# EAGLE design devkit (EAGLE 7.7.0)
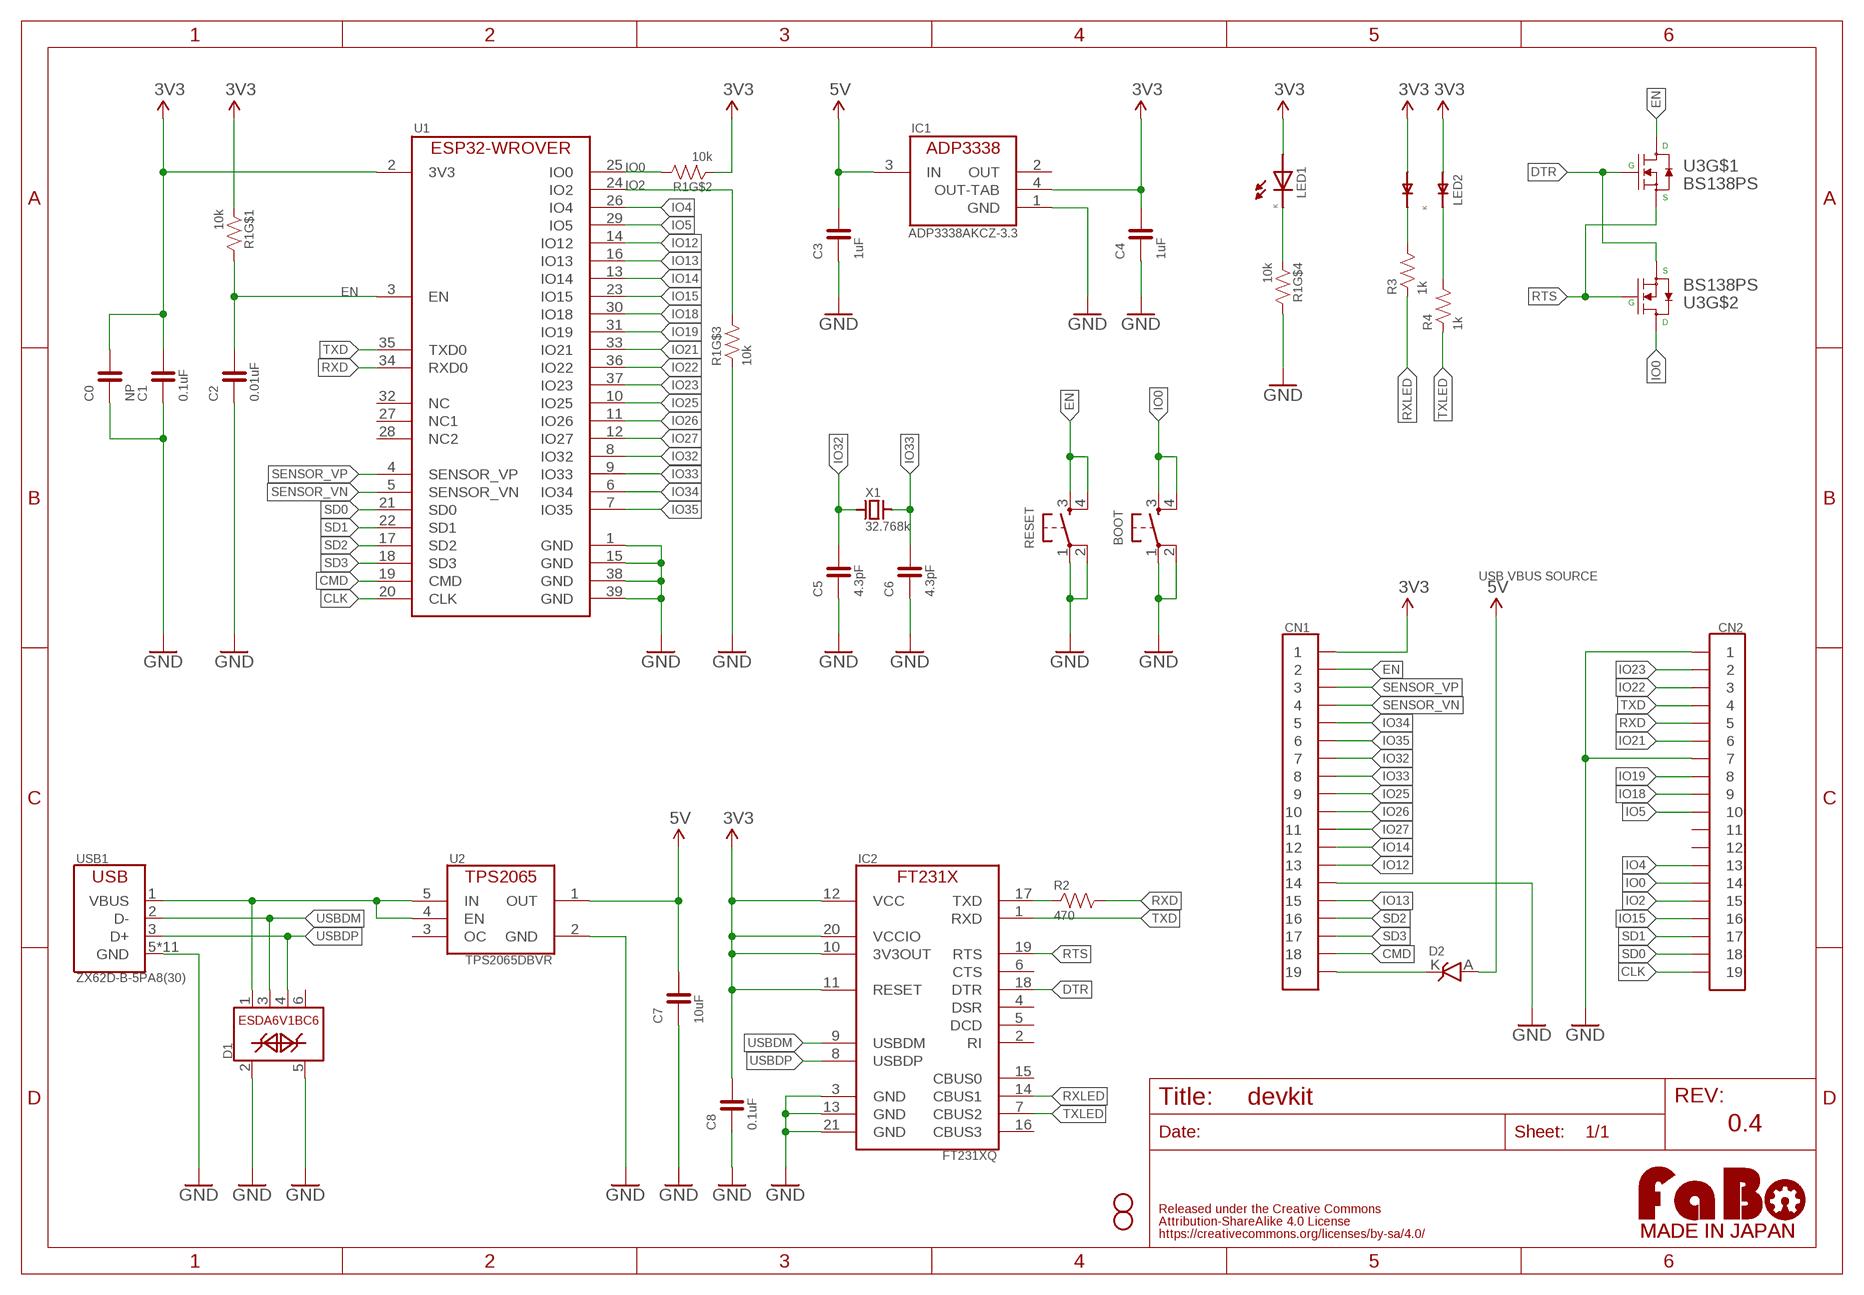
[diagram p0: schematic, sheet 1]

## Parts
BOOT  TACTILE-KMR2  [KMR2-TACT]
C0  NP  CAPACITOR-M  [MULTIPAD0603]
C1  0.1uF  CAPACITOR-0603  [EIA0603]
C2  0.01uF  CAPACITOR-0603  [EIA0603]
C3  1uF  CAPACITOR-0603  [EIA0603]
C4  1uF  CAPACITOR-0603  [EIA0603]
C5  4.3pF  CAPACITOR-0603  [EIA0603]
C6  4.3pF  CAPACITOR-0603  [EIA0603]
C7  10uF  CAPACITOR-0603  [EIA0603]
C8  0.1uF  CAPACITOR-0603  [EIA0603]
CN1  PIN_1X19  [PIN_1X19]
CN2  PIN_1X19  [PIN_1X19]
D1  ESDA6V1BC6  [SOT-23-6L]
D2  DIODE_SCHOTTKY-RB161MM-20  [SOD-123FL_RB161MM-20]
FID1  FIDUCIAL-TOP  [FIDUCIAL_15_TOP]
FID2  FIDUCIAL-TOP  [FIDUCIAL_15_TOP]
IC1  ADP3338AKCZ-3.3  ADP3338AKCZ  [SOT-223-KC3]
IC2  FT231XQ  [QFN-20]
LED1  LED-0603  [LED_0603]
LED2  HSMF-C16X  [HSMF-C16X]
LOGO1  LOGO_FABO-M_BOTTOM  [LOGO_FABO_M_BOTTOM]
R1  10k  RESISTOR_ARRAY  [EXBV8V]
R2  470  RESISTOR-0603  [EIA0603]
R3  1k  RESISTOR-0603  [EIA0603]
R4  1k  RESISTOR-0603  [EIA0603]
RESET  TACTILE-KMR2  [KMR2-TACT]
U1  ESP32-WROVER-B  [ESP32-WROVER-B]
U2  TPS2065DBVR  TPS2065DBV  [SOT-23-5]
U3  BS138PS  [SOT-363]
USB1  ZX62D-B-5PA8(30)  USB-ZX62D  [ZX62D-B-5PA8]
X1  32.768k  CRYSTAL-ABS07  [ABS07]

## Nets
3V3: C0.2 C1.2 C4.2 C8.2 CN1.1 IC1.4(OUT-TAB) IC2.10(3V3OUT) IC2.11(RESET) IC2.12(VCC) IC2.20(VCCIO) LED1.A(ANODE) LED2.1(A1) LED2.2(A2) R1.1 R1.2 U1.2(3V3)
5V: C3.2 C7.2 D2.A IC1.3(IN) U2.1(OUT)
CLK: CN2.19 U1.20(CLK)
CMD: CN1.18 U1.19(CMD)
DTR: IC2.18(DTR) U3.2(G) U3.4(S)
EN: C2.2 CN1.2 R1.8 RESET.3 RESET.4 U1.3(EN) U3.6(D)
GND: BOOT.1 BOOT.2 C0.1 C1.1 C2.1 C3.1 C4.1 C5.1 C6.1 C7.1 C8.1 CN1.14 CN2.1 CN2.7 D1.2 D1.5 IC1.1(GND) IC2.3(GND) IC2.13(GND) IC2.21(GND) R1.3 R1.5 RESET.1 RESET.2 U1.1(GND) U1.15(GND) U1.38(GND) U1.39(GND) U2.2(GND) USB1.5(GND) USB1.B1(GND) USB1.B2(GND) USB1.B3(GND) USB1.B4(GND) USB1.T1(GND) USB1.T2(GND) USB1.T3(GND) USB1.T4(GND) USB1.T5(GND) USB1.T6(GND)
IO0: BOOT.3 BOOT.4 CN2.14 R1.7 U1.25(IO0) U3.3(D)
IO2: CN2.15 R1.6 U1.24(IO2)
IO4: CN2.13 U1.26(IO4)
IO5: CN2.10 U1.29(IO5)
IO12: CN1.13 U1.14(IO12)
IO13: CN1.15 U1.16(IO13)
IO14: CN1.12 U1.13(IO14)
IO15: CN2.16 U1.23(IO15)
IO18: CN2.9 U1.30(IO18)
IO19: CN2.8 U1.31(IO19)
IO21: CN2.6 U1.33(IO21)
IO22: CN2.3 U1.36(IO22)
IO23: CN2.2 U1.37(IO23)
IO25: CN1.9 U1.10(IO25)
IO26: CN1.10 U1.11(IO26)
IO27: CN1.11 U1.12(IO27)
IO32: C5.2 CN1.7 U1.8(IO32) X1.1
IO33: C6.2 CN1.8 U1.9(IO33) X1.2
IO34: CN1.5 U1.6(IO34)
IO35: CN1.6 U1.7(IO35)
LED1K: LED1.K(CATHODE) R1.4
LED2K1: LED2.4(K2) R3.2
LED2K2: LED2.3(K1) R4.2
OUT5V: CN1.19 D2.K
RTS: IC2.19(RTS) U3.1(S) U3.5(G)
RXD: CN2.5 R2.2 U1.34(RXD0)
RXLED: IC2.14(CBUS1) R3.1
SD0: CN2.18 U1.21(SD0)
SD1: CN2.17 U1.22(SD1)
SD2: CN1.16 U1.17(SD2)
SD3: CN1.17 U1.18(SD3)
SENSOR_VN: CN1.4 U1.5(SENSOR_VN)
SENSOR_VP: CN1.3 U1.4(SENSOR_VP)
TXD: CN2.4 IC2.1(RXD) U1.35(TXD0)
TXLED: IC2.7(CBUS2) R4.1
TXPIN: IC2.17(TXD) R2.1
USBDM: D1.3 IC2.9(USBDM) USB1.2(D-)
USBDP: D1.4 IC2.8(USBDP) USB1.3(D+)
USBVBUS: D1.1 U2.4(EN) U2.5(IN) USB1.1(VBUS)
Unconnected: CN2.11 CN2.12 D1.6 IC1.2(OUT) IC2.2(RI) IC2.4(DSR) IC2.5(DCD) IC2.6(CTS) IC2.15(CBUS0) IC2.16(CBUS3) U1.27(NC1) U1.28(NC2) U1.32(NC) U2.3(OC)

## Notes on the sheet
- USB VBUS SOURCE
- 0.4

## Library data of the parts
BOOT RESET = component:TACTILE
C0 C1-C8 = component:CAPACITOR
CN1 CN2 = component:PIN_1X19
D1 = component:ESDA6V1BC6
D2 = component:DIODE_SCHOTTKY
FID1 FID2 = component:FIDUCIAL
IC1 = component:ADP3338AKCZ
IC2 = component:FT231X
LED1 = component:LED
LED2 = component:HSMF-C16X
LOGO1 = component:LOGO_FABO
R1 = component:RESISTOR_ARRAY
R2-R4 = component:RESISTOR
U1 = component:ESP32-WROVER-B
U2 = component:TPS2065
U3 = component:BS138PS
USB1 = component:USB
X1 = component:CRYSTAL

## Board
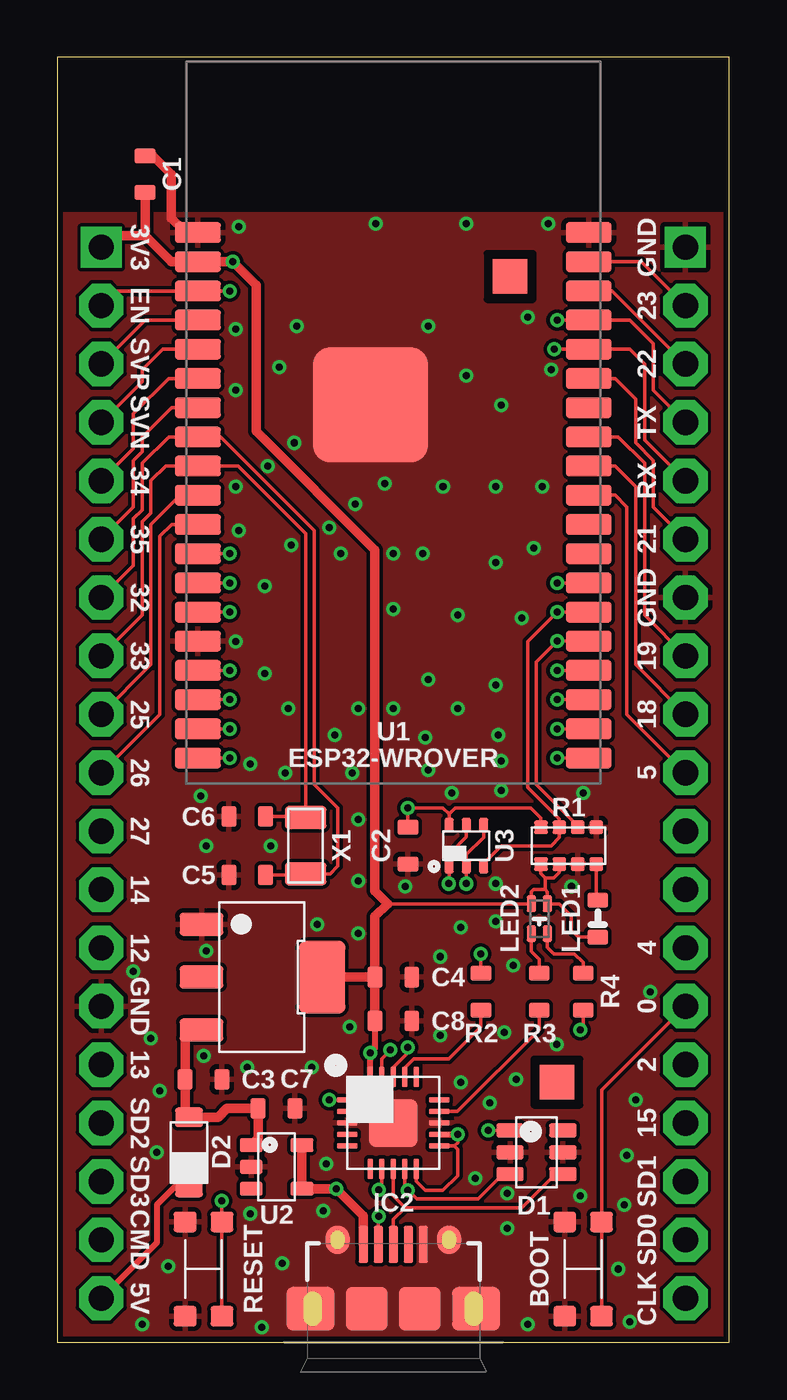
[diagram p1: board, top side]
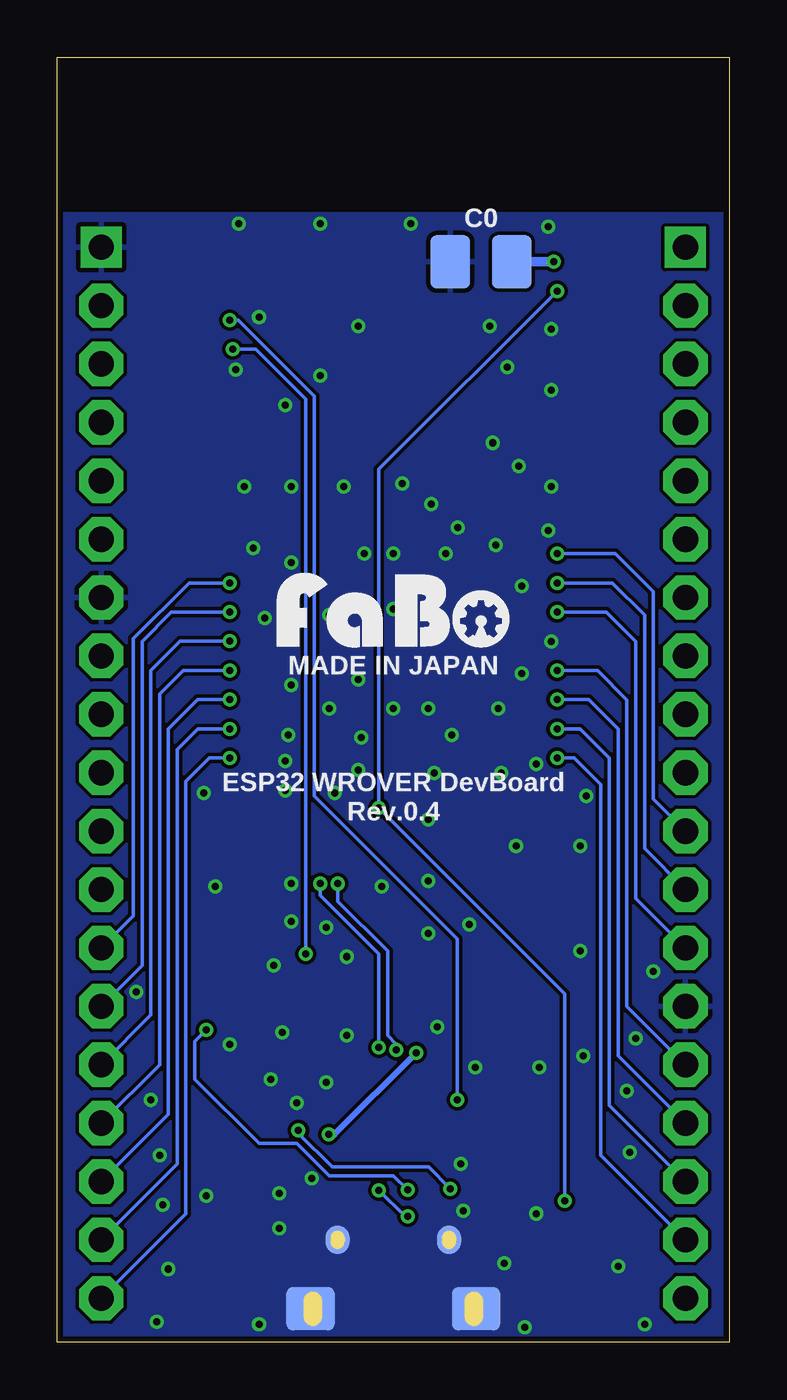
[diagram p2: board, bottom side, seen from below]

Size 29.21 x 55.88 mm. Coordinates in mm from the lower left corner, seen from the top.
Outline: 0,0 29.21,0 29.21,55.88 0,55.88 0,0
Copper layers (1*16): Top 0.035mm / dielectric 1.6mm / Bottom 0.035mm
Design rules "PCBway": minimum track width 6mil, minimum drill 12mil, track to track 6mil, track to pad 6mil, pad to pad 6mil, via to via 6mil, smd to smd 6mil, copper to edge 10mil, drill to drill 10mil, minimum pad ring 10mil, minimum via ring 6mil, stop-mask expansion 2mil, vias tented up to drill 100mil, thermal gap 8mil

### Footprints (pad centres in the part's own frame; a part is rotated, then mirrored left to right if it is on the bottom)
KMR2-TACT = smd 0.9 x 1: 1 -2.05,0.8; 2 2.05,0.8; 3 2.05,-0.8; 4 -2.05,-0.8
MULTIPAD0603 = smd 1.725 x 2.3: 1 -1.337,0; 2 1.337,0
EIA0603 = smd 0.65 x 0.9: 1 -0.8,0; 2 0.8,0
PIN_1X19 = drill 1.1 pad 1.778 square: 1 -22.86,0 | drill 1.1 pad 1.93 octagon: 2 -20.32,0; 3 -17.78,0; 4 -15.24,0; 5 -12.7,0; 6 -10.16,0; 7 -7.62,0; 8 -5.08,0; 9 -2.54,0; 10 0,0; 11 2.54,0; 12 5.08,0; 13 7.62,0; 14 10.16,0; 15 12.7,0; 16 15.24,0; 17 17.78,0; 18 20.32,0; 19 22.86,0
SOT-23-6L = smd 0.6 x 1.2: 1 -0.95,-1.15; 2 0,-1.15; 3 0.95,-1.15; 4 0.95,1.15; 5 0,1.15; 6 -0.95,1.15
SOD-123FL_RB161MM-20 = smd 0.85 x 1.2: A 1.525,0; K -1.525,0
FIDUCIAL_15_TOP = smd 1.5 x 1.5: P$1 0,0
SOT-223-KC3 = smd 1 x 1.9: 1 -2.3,-2.625; 2 0,-2.625; 3 2.3,-2.625 | smd 3.15 x 2: 4 0,2.625
QFN-20 = smd 0.9 x 0.25: 1 -2,1; 2 -2,0.5; 3 -2,0; 4 -2,-0.5; 5 -2,-1; 11 2,-1; 12 2,-0.5; 13 2,0; 14 2,0.5; 15 2,1 | smd 0.25 x 0.9: 6 -1,-2; 7 -0.5,-2; 8 0,-2; 9 0.5,-2; 10 1,-2; 16 1,2; 17 0.5,2; 18 0,2; 19 -0.5,2; 20 -1,2 | smd 2.1 x 2.1: 21 0,0
LED_0603 = smd 0.65 x 0.9: A -0.8,0; K 0.8,0
HSMF-C16X = smd 0.7 x 0.4: 1 -0.65,0.35; 2 -0.65,-0.35; 3 0.65,0.35; 4 0.65,-0.35
EXBV8V = smd 0.6 x 0.6: 1 -1.2,-0.8; 2 -0.4,-0.8; 3 0.4,-0.8; 4 1.2,-0.8; 5 1.2,0.8; 6 0.4,0.8; 7 -0.4,0.8; 8 -1.2,0.8
ESP32-WROVER-B = smd 2 x 0.9: 1 -8.5,8.26; 2 -8.5,6.99; 3 -8.5,5.72; 4 -8.5,4.45; 5 -8.5,3.18; 6 -8.5,1.91; 7 -8.5,0.64; 8 -8.5,-0.63; 9 -8.5,-1.9; 10 -8.5,-3.17; 11 -8.5,-4.44; 12 -8.5,-5.71; 13 -8.5,-6.98; 14 -8.5,-8.25; 15 -8.5,-9.52; 16 -8.5,-10.79; 17 -8.5,-12.06; 18 -8.5,-13.33; 19 -8.5,-14.6; 20 8.5,-14.6; 21 8.5,-13.33; 22 8.5,-12.06; 23 8.5,-10.79; 24 8.5,-9.52; 25 8.5,-8.25; 26 8.5,-6.98; 27 8.5,-5.71; 28 8.5,-4.44; 29 8.5,-3.17; 30 8.5,-1.9; 31 8.5,-0.63; 32 8.5,0.64; 33 8.5,1.91; 34 8.5,3.18; 35 8.5,4.45; 36 8.5,5.72; 37 8.5,6.99; 38 8.5,8.26 | smd 5 x 5: 39 -1,0.76
SOT-23-5 = smd 0.6 x 1: 1 -0.95,-1.1; 2 0,-1.1; 3 0.95,-1.1; 4 0.95,1.1; 5 -0.95,1.1
SOT-363 = smd 0.6 x 0.4: 1 -0.9,0.75; 2 -0.9,0; 3 -0.9,-0.75; 4 0.9,-0.75; 5 0.9,0; 6 0.9,0.75
ZX62D-B-5PA8 = smd 0.4 x 1.6: 1 -1.3,4.25; 2 -0.65,4.25; 3 0,4.25; 4 0.65,4.25; 5 1.3,4.25 | smd 1.05 x 1.25 bottom: B1 -2.425,4.45; B2 2.425,4.45 | smd 2.1 x 1.9 bottom: B3 -3.6,1.45; B4 3.6,1.45 | smd 1.05 x 1.25: T1 -2.425,4.45; T2 2.425,4.45 | smd 2.1 x 1.9: T3 -3.6,1.45; T6 3.6,1.45 | smd 1.8 x 1.9: T4 -1.15,1.45; T5 1.15,1.45
ABS07 = smd 1 x 1.8: 1 -1.225,0; 2 1.225,0

### Placement (x,y rotation side)
BOOT  22.86,3.17 90 top
C0  10.79,46.99 0 bottom
C1  3.81,50.8 270 top
C2  15.24,21.59 90 top
C3  6.35,11.43 180 top
C4  14.61,15.88 180 top
C5  8.26,20.32 0 top
C6  8.26,22.86 0 top
C7  9.53,10.16 180 top
C8  14.61,13.97 180 top
CN1  1.91,24.77 270 top
CN2  27.3,24.77 270 top
D1  20.83,8.26 270 top
D2  5.71,8.26 90 top
FID1  19.68,46.35 0 top
FID2  21.72,11.3 0 top
IC1  8.89,15.88 270 top
IC2  14.61,9.53 0 top
LED1  23.5,18.41 90 top
LED2  20.95,18.41 270 top
LOGO1  14.61,29.84 0 top
R1  22.23,21.59 0 top
R2  18.41,15.24 90 top
R3  20.95,15.24 90 top
R4  22.86,15.24 90 top
RESET  6.35,3.17 90 top
U1  14.61,40.01 0 top
U2  9.53,7.62 270 top
U3  17.78,21.59 90 top
USB1  14.61,0 0 top
X1  10.79,21.59 90 top

### Tracks (layer width: path | path; a pad name or v marks a point on that pad's centre or on a via)
3V3  (via drill 0.3)
  Top 0.152: IC2.10 15.61,7 16,6.6 16.76,6.6 17.4,7.24 17.4,8.38 17.26,8.53 | IC2.11 17.26,8.53 | v17.41,9.03 17.4,9.02 17.4,8.67 17.26,8.53 | 14.37,19.07 LED2.2 20.61,19.59 20.7,19.68 21.21,19.68 | R1.1 21.02,20.38 21.21,20.19 | 21.21,20.19 21.59,20.19 21.82,20.43 R1.2 | 21.21,19.68 21.3,19.59 LED2.1 21.83,19.07 22.35,18.54 22.35,17.91 22.64,17.61 LED1.A | 21.21,20.19 21.21,19.68
  Top 0.254: IC2.20 v13.61,12.59 13.8,12.79 C8.2 | IC2.12 v17.41,9.03
  Top 0.406: 3.81,48.13 4.95,46.99 U1.2 v7.62,46.99 8.64,45.98 8.64,39.62 13.8,34.45 13.8,19.63 14.37,19.07 13.8,18.5 C4.2 | C1.2 3.81,48.13 | 3.81,48.13 2.41,48.13 CN1.1 | C4.2 IC1.4 | C4.2 C8.2
  Bottom 0.254: v17.41,9.03 17.17,9.03 v13.61,12.59
  Bottom 0.406: C0.2 v7.62,46.99
5V
  Top 0.406: U2.1 8.72,8.87 C7.2 7.37,10.16 6.99,9.78 D2.A 5.55,9.95 C3.2 5.55,13.17 5.96,13.57 IC1.3
CLK  (via drill 0.3)
  Top 0.152: U1.20 v21.72,25.41
  Bottom 0.152: CN2.19 23.62,5.59 23.62,24.39 22.61,25.41 v21.72,25.41
CMD  (via drill 0.3)
  Top 0.152: U1.19 v7.49,25.41
  Bottom 0.152: CN1.18 5.59,8.13 5.59,24.26 6.74,25.41 v7.49,25.41
DTR  (via drill 0.3)
  Top 0.152: U3.4 18.53,21.96 17.78,21.21 U3.2 v17.78,19.94 | IC2.18 14.61,11.94 15.24,12.57 v15.24,12.83
  Bottom 0.152: v15.24,12.83 15.24,16.89 17.78,19.43 v17.78,19.94
EN  (via drill 0.3)
  Top 0.152: CN1.2 2.54,45.73 U1.3 v7.49,45.73 | RESET.4 RESET.3 v7.15,6.13 | C2.2 v15.24,23.24 16.76,23.24 17.03,22.98 | U3.6 17.03,22.98 | R1.8 21.02,22.79 20.57,23.24 17.3,23.24 17.03,22.98
  Bottom 0.152: v7.15,6.13 7.15,15.15 v15.24,23.24 15.24,37.97 v7.49,45.73
GND  (via drill 0.3)
  Top 0.406: C1.1 4.15,51.6 4.95,50.8 4.95,48.9 5.46,48.39 5.98,48.39 U1.1
  other vias: 19.3,24 9.14,38.1 21.34,48.64 13.84,48.64 17.78,48.64 21.46,42.29 20.45,44.58 17.78,42.04 19.3,40.77 20.19,31.5 17.4,31.62 19.05,28.57 21.08,37.21 19.05,37.21 14.22,37.34 16.76,37.21 12.32,34.29 14.61,34.29 15.88,34.29 10.16,34.67 7.75,37.21 11.81,35.43 12.95,36.45 10.29,39.12 7.87,35.31 9.91,24.77 12.83,24.77 16.13,24.89 19.18,26.42 19.3,25.27 16,26.29 14.61,27.56 13.08,27.56 10.03,27.56 8.38,25.15 6.22,23.75 6.48,21.59 9.27,21.59 13.08,22.73 13.08,20.07 15.11,19.81 20.7,34.54 19.05,33.91 10.41,44.2 9.65,42.42 7.75,44.07 7.75,41.4 16.13,44.2 9.02,32.89 9.02,29.08 16.13,28.83 12.06,26.42 19.05,18.29 19.05,19.94 13.08,17.78 11.3,18.16 6.48,17.02 12.7,13.72 16.64,13.34 16.64,16.76 19.81,16.38 21.72,12.95 19.43,13.46 17.53,11.3 18.8,10.41 11.05,11.94 8.26,11.94 4.45,10.92 4.06,13.21 6.35,12.45 4.32,8.26 8.38,5.59 11.56,5.71 11.68,7.75 9.78,3.43 4.83,3.3 3.68,0.76 8.89,0.64 24.89,0.89 24.38,3.17 24.64,5.97 20.45,0.76 19.56,4.95 18.16,7.11 19.56,6.48 22.73,6.35 24.77,8.13 25.15,10.54 19.94,11.43 17.53,18.03 3.3,16.13 25.78,15.24 22.35,19.81 22.86,23.88 17.14,23.88 14.61,31.88 7.75,30.48 7.87,48.51 17.4,27.56
  pour Top (isolate 0.152, rank 3): 0,0 29.21,0 29.21,49.08 0,49.08
  pour Bottom (isolate 0.152, rank 3): 0,0 29.21,0 29.21,49.08 0,49.08
  pour Bottom (rank 2, no thermals): 9.53,0 9.53,3.17 10.79,3.17 10.79,5.71 18.41,5.71 18.41,3.17 19.68,3.17 19.68,0
  pour Top (rank 2, no thermals): 9.53,0 9.53,3.17 10.79,3.17 10.79,5.71 18.41,5.71 18.41,3.17 19.68,3.17 19.68,0
  pour Top (rank 2, no thermals): 12.7,11.43 16.51,11.43 16.51,7.62 12.7,7.62
  pour Top (rank 2, no thermals): 16.38,40.77 16.38,37.97 10.79,37.97 10.79,43.31 10.79,43.56 16.38,43.56
IO0  (via drill 0.3)
  Top 0.152: U3.3 18.53,20.82 19.3,21.59 21.46,21.59 21.82,21.95 R1.7 21.82,22.75 20.45,24.13 20.45,30.48 v21.72,31.75 U1.25 | BOOT.4 BOOT.3 23.66,10.96 CN2.14
  Bottom 0.152: CN2.14 25.53,16.38 25.53,30.48 24.26,31.75 v21.73,31.75 v21.72,31.75
IO2  (via drill 0.3)
  Top 0.152: U1.24 v21.72,30.48 20.83,29.59 20.83,24.26 22.62,22.46 R1.6
  Bottom 0.152: CN2.15 25.15,14.22 25.15,29.21 23.87,30.48 v21.72,30.48
IO4  (via drill 0.3)
  Top 0.152: U1.26 v21.72,33.02
  Bottom 0.152: CN2.13 25.91,18.54 25.91,30.61 23.49,33.02 v21.72,33.02
IO5
  Top 0.152: U1.29 24.25,36.84 24.77,36.32 24.77,27.3 CN2.10
IO12  (via drill 0.3)
  Top 0.152: U1.14 v7.49,31.75
  Bottom 0.152: CN1.13 4.06,19.3 4.06,30.48 5.34,31.75 v7.49,31.75
IO13  (via drill 0.3)
  Top 0.152: U1.16 v7.49,29.21
  Bottom 0.152: CN1.15 4.45,14.61 4.45,27.94 5.72,29.21 v7.49,29.21
IO14  (via drill 0.3)
  Top 0.152: U1.13 v7.49,33.02
  Bottom 0.152: CN1.12 3.68,21.46 3.68,31.62 5.08,33.02 v7.49,33.02
IO15  (via drill 0.3)
  Top 0.152: U1.23 v21.72,29.21
  Bottom 0.152: CN2.16 24.77,12.06 24.77,28.19 23.75,29.21 v21.73,29.21 v21.72,29.21
IO18
  Top 0.152: U1.30 24.25,38.1 25.15,37.21 25.15,29.46 CN2.9
IO19
  Top 0.152: U1.31 24.38,39.38 25.53,38.23 25.53,31.62 CN2.8
IO21
  Top 0.152: U1.33 24.25,41.91 25.15,41.02 25.15,39.12 25.91,38.35 25.91,36.32 CN2.6
IO22
  Top 0.152: U1.36 24.12,45.73 CN2.3
IO23
  Top 0.152: U1.37 25.39,46.99 CN2.2
IO25
  Top 0.152: U1.10 5.34,36.84 4.06,35.56 4.06,29.46 CN1.9
IO26
  Top 0.152: U1.11 4.96,35.56 4.45,35.05 4.45,27.3 CN1.10
IO27  (via drill 0.3)
  Top 0.152: U1.12 v7.49,34.3
  Bottom 0.152: CN1.11 3.3,23.62 3.3,32.64 4.96,34.3 v7.49,34.3
IO32
  Top 0.152: CN1.7 3.3,33.78 3.3,35.81 3.68,36.2 3.68,38.23 4.83,39.38 U1.8 7.11,39.38 11.18,35.31 11.18,24.26 12.19,23.24 12.19,20.7 11.86,20.36 X1.1 10.75,20.32 C5.2
IO33
  Top 0.152: CN1.8 3.68,31.62 3.68,35.69 4.06,36.07 4.06,37.47 4.7,38.1 U1.9 7.87,38.1 10.79,35.18 X1.2 10.75,22.86 C6.2
IO34
  Top 0.152: U1.6 4.83,41.91 3.3,40.39 3.3,38.86 CN1.5
IO35
  Top 0.152: U1.7 4.96,40.65 3.68,39.37 3.68,38.73 3.3,38.35 3.3,36.32 CN1.6
LED1K
  Top 0.152: R1.4 23.43,19.29 LED1.K
LED2K1
  Top 0.152: LED2.4 20.61,16.99 20.95,16.64 R3.2
LED2K2
  Top 0.152: LED2.3 21.3,17.18 21.59,16.89 22.48,16.89 22.86,16.51 R4.2
OUT5V
  Top 0.254: D2.K 5.08,6.73 4.32,5.97 4.32,4.32 CN1.19
RTS  (via drill 0.3)
  Top 0.152: U3.5 17.78,21.97 17.03,21.22 U3.1 17.03,19.95 v17.02,19.94 | IC2.19 14.11,12.33 v14.48,12.7
  Bottom 0.152: v14.48,12.7 14.48,12.95 14.86,13.34 14.86,17.02 17.02,19.18 v17.02,19.94
RXD  (via drill 0.3)
  Top 0.152: CN2.5 25.53,39.24 25.53,42.55 24.89,43.19 U1.34 v21.59,43.19 | R2.2 v18.41,16.89
  Bottom 0.152: v18.41,16.89 18.41,41.02 20.58,43.19 v21.59,43.19
RXLED
  Top 0.152: IC2.14 17.39,10.03 20.95,13.59 R3.1
SD0  (via drill 0.3)
  Top 0.152: U1.21 v21.72,26.68
  Bottom 0.152: CN2.18 24,7.75 24,25.78 U1.21 v21.72,26.68
SD1  (via drill 0.3)
  Top 0.152: U1.22 v21.72,27.95
  Bottom 0.152: CN2.17 24.38,9.91 24.38,26.67 U1.22 v21.72,27.95
SD2  (via drill 0.3)
  Top 0.152: U1.17 v7.49,27.95
  Bottom 0.152: CN1.16 4.83,12.45 4.83,26.67 U1.17 v7.49,27.95
SD3  (via drill 0.3)
  Top 0.152: U1.18 v7.49,26.68
  Bottom 0.152: CN1.17 5.21,10.29 5.21,25.4 6.48,26.68 v7.49,26.68
SENSOR_VN
  Top 0.152: CN1.4 3.68,41.78 3.68,42.29 4.58,43.19 U1.5
SENSOR_VP
  Top 0.152: U1.4 3.81,44.45 CN1.3
TXD  (via drill 0.3)
  Top 0.152: CN2.4 25.91,41.4 25.91,43.43 24.89,44.45 U1.35 v21.72,44.45 | IC2.1 v11.83,10.53
  Bottom 0.152: v11.83,10.53 11.83,17.54 18.03,23.75 18.03,41.15 21.34,44.45 v21.72,44.45
TXLED  (via drill 0.3)
  Top 0.152: IC2.7 14.11,6.74 v13.98,6.61 | R4.1 22.86,13.72 v22.73,13.59
  Bottom 0.152: v13.98,6.61 14.61,7.24 17.4,7.24 18.8,8.64 20.45,8.64 23.24,11.43 23.24,13.08 v22.73,13.59
TXPIN
  Top 0.152: IC2.17 15.11,11.93 15.49,12.32 17.02,12.32 18.41,13.72 R2.1
USBDM  (via drill 0.3)
  Top 0.152: IC2.9 15.11,6.74 v15.24,6.6 15.62,6.22 18.29,6.22 19.37,7.3 D1.3 | USB1.2 13.96,5.45 v13.97,5.46
  Bottom 0.152: v13.97,5.46 14.1,5.46 v15.24,6.6
USBDP
  Top 0.152: IC2.8 14.61,6.35 15.11,5.84 | USB1.3 14.61,5.33 15.11,5.84 | 15.11,5.84 20.19,5.84 21.66,7.3 D1.4
USBVBUS  (via drill 0.3)
  Top 0.152: D1.1 v18.73,9.21
  Top 0.406: USB1.1 13.3,5.49 v12.13,6.67 U2.4 U2.5
  Bottom 0.152: v12.13,6.67 13.08,7.62 17.27,7.62 18.73,9.08 v18.73,9.21

### Text on the board
tPlace: 3V3 | GND | EN | 23 | SVP | 22 | SVN | TX | 34 | RX | 35 | 21 | 32 | GND | 33 | 19 | 25 | 18 | 26 | 5 | 27 | 14 | 12 | 4 | GND | 0 | 13 | 2 | SD2 | 15 | SD3 | SD1 | CMD | SD0 | 5V | CLK
bPlace: MADE IN JAPAN | ESP32 WROVER DevBoard | Rev.0.4